# Altium schematic sheet FPGAboard.SchDoc
size A2
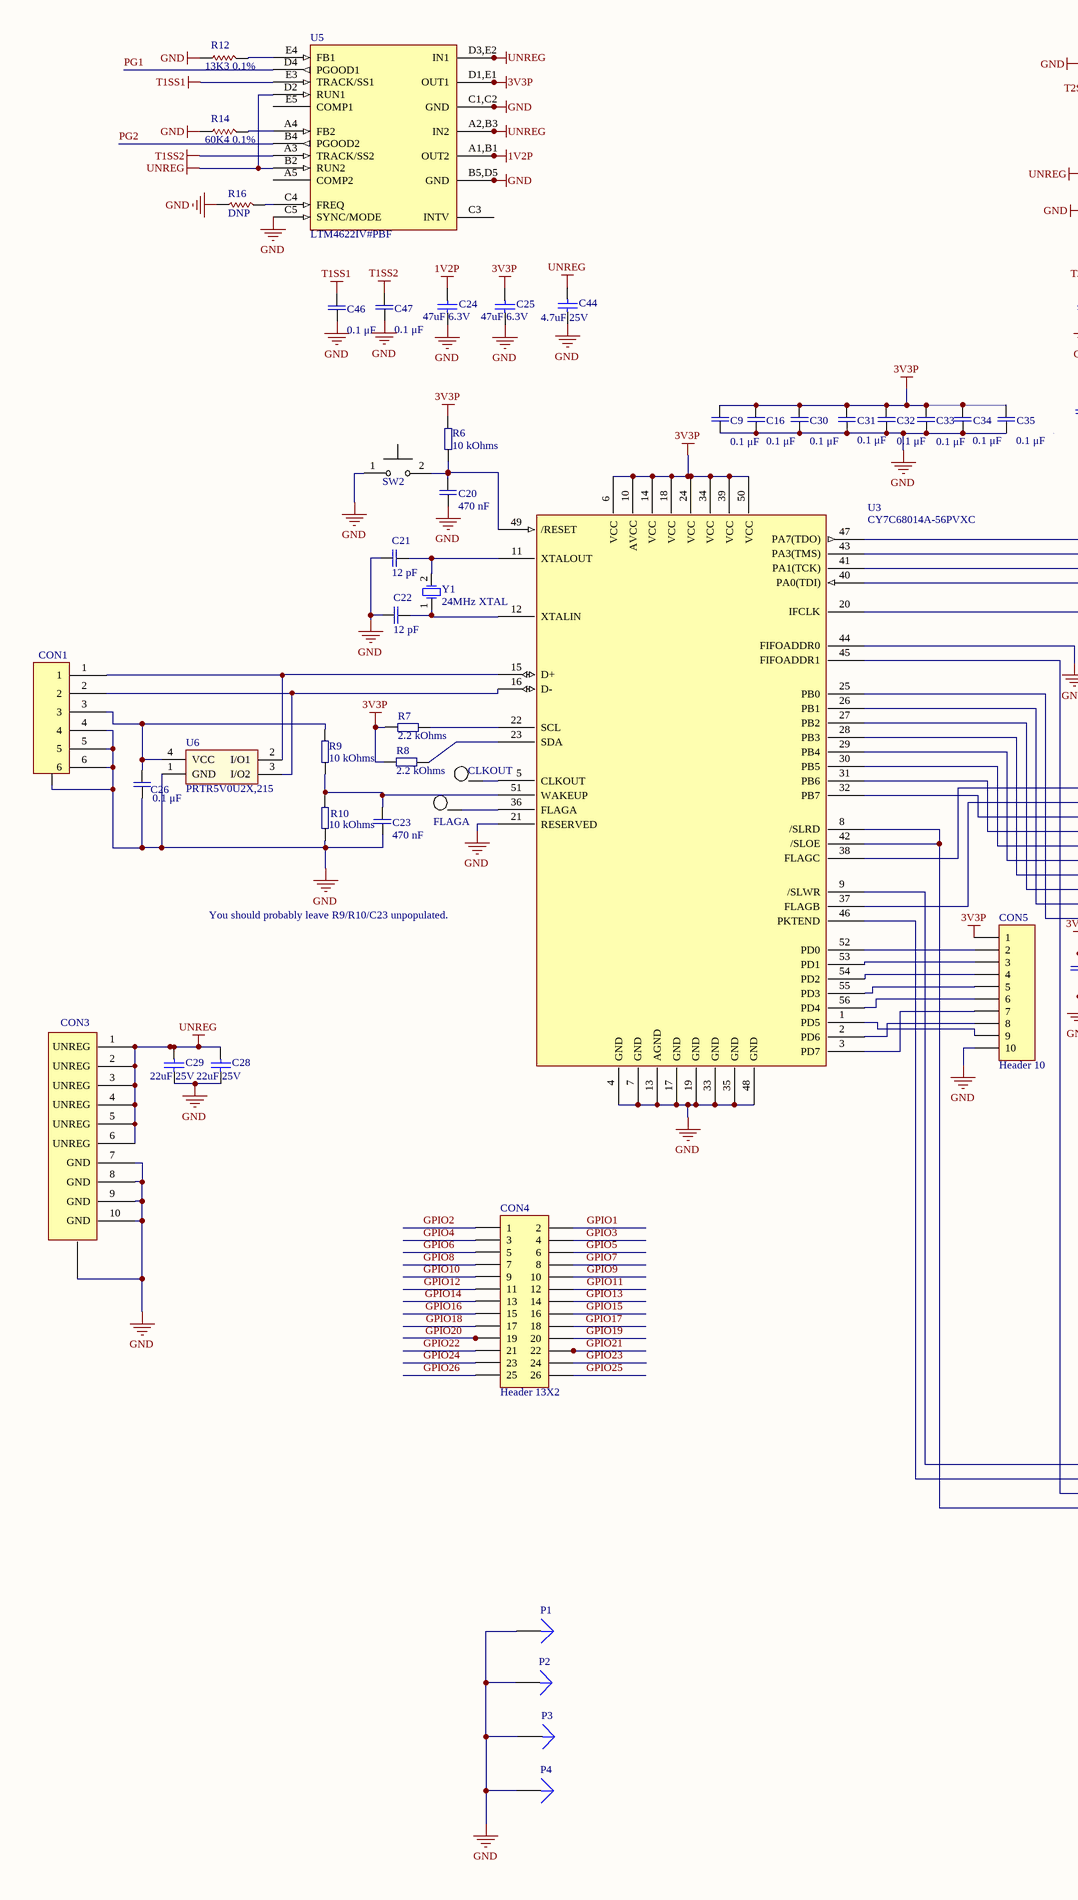
[diagram p0: FPGAboard.SchDoc, left]
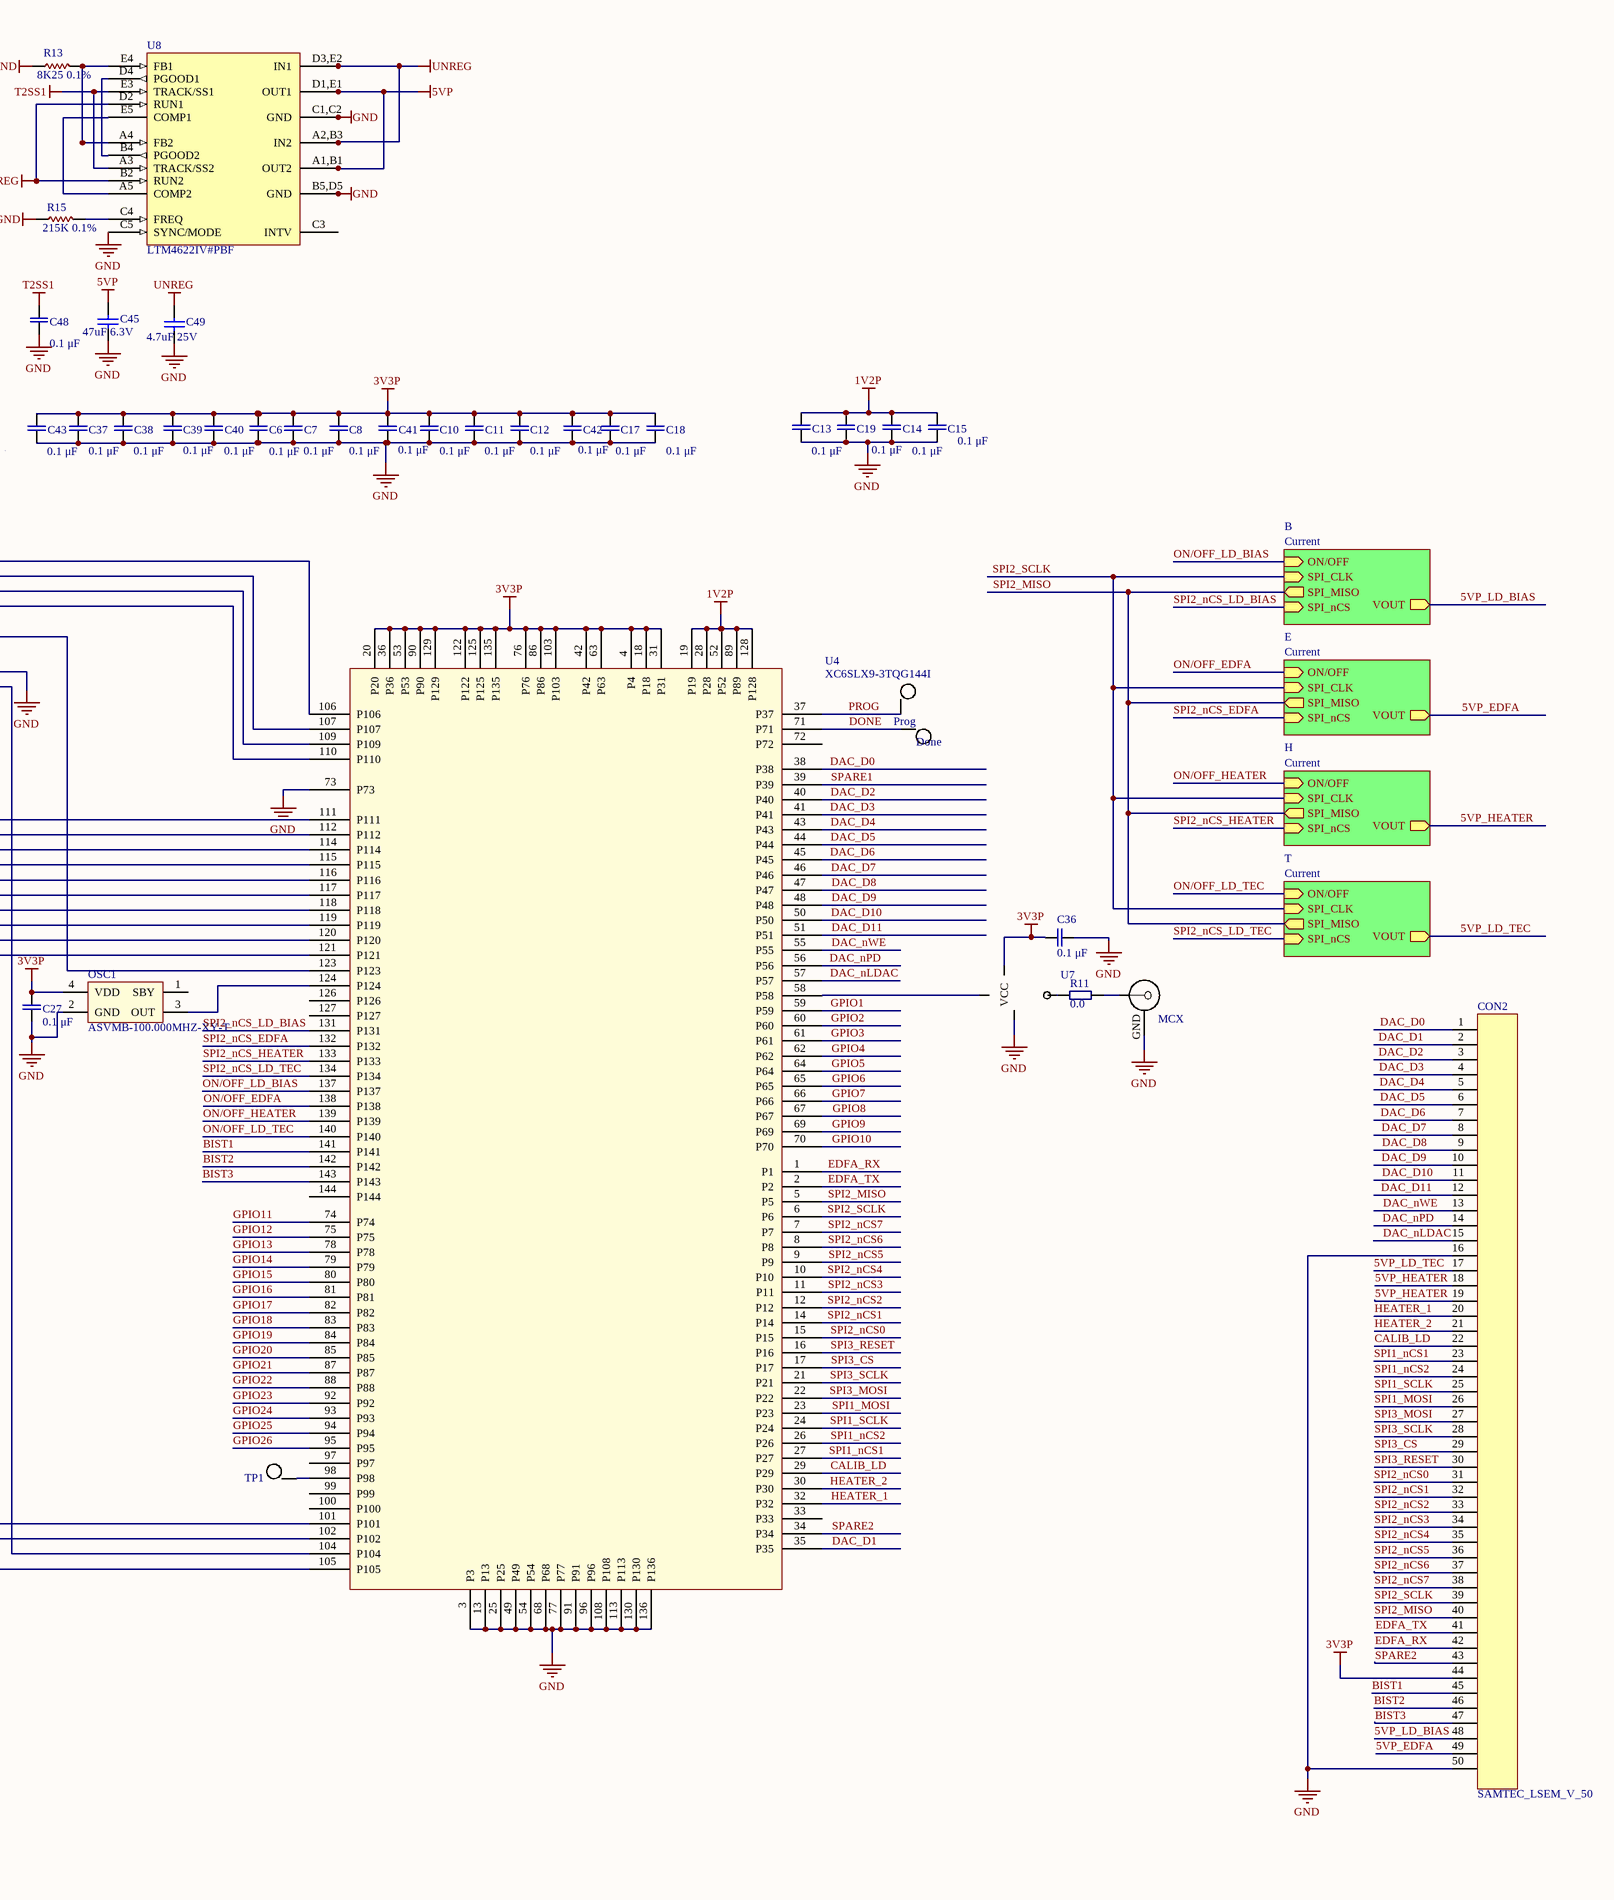
[diagram p1: FPGAboard.SchDoc, right]

## Parts
C6  Capacitance: 0.1 μF  [0805_X7R_KEMET]  (hidden comment: C0805C104K5RACTU)
C7  Capacitance: 0.1 μF  [0805_X7R_KEMET]  (hidden comment: C0805C104K5RACTU)
C8  Capacitance: 0.1 μF  [0805_X7R_KEMET]  (hidden comment: C0805C104K5RACTU)
C9  Capacitance: 0.1 μF  [0805_X7R_KEMET]  (hidden comment: C0805C104K5RACTU)
C10  Capacitance: 0.1 μF  [0805_X7R_KEMET]  (hidden comment: C0805C104K5RACTU)
C11  Capacitance: 0.1 μF  [0805_X7R_KEMET]  (hidden comment: C0805C104K5RACTU)
C12  Capacitance: 0.1 μF  [0805_X7R_KEMET]  (hidden comment: C0805C104K5RACTU)
C13  Capacitance: 0.1 μF  [0805_X7R_KEMET]  (hidden comment: C0805C104K5RACTU)
C14  Capacitance: 0.1 μF  [0805_X7R_KEMET]  (hidden comment: C0805C104K5RACTU)
C15  Capacitance: 0.1 μF  [0805_X7R_KEMET]  (hidden comment: C0805C104K5RACTU)
C16  Capacitance: 0.1 μF  [0805_X7R_KEMET]  (hidden comment: C0805C104K5RACTU)
C17  Capacitance: 0.1 μF  [0805_X7R_KEMET]  (hidden comment: C0805C104K5RACTU)
C18  Capacitance: 0.1 μF  [0805_X7R_KEMET]  (hidden comment: C0805C104K5RACTU)
C19  Capacitance: 0.1 μF  [0805_X7R_KEMET]  (hidden comment: C0805C104K5RACTU)
C20  Capacitance - nF: 470 nF  [0805_X7R_KEMET]  (hidden comment: C0805C474K5RACTU)
C21  Capacitance: 12 pF  [0805_X7R_KEMET]  (hidden comment: C0805C120J5GACTU)
C22  Capacitance: 12 pF  [0805_X7R_KEMET]  (hidden comment: C0805C120J5GACTU)
C23  Capacitance - nF: 470 nF  [0805_X7R_KEMET]  (hidden comment: C0805C474K5RACTU)
C24  47uF 6.3V  [CAPC0805(2012)145_M]
C25  47uF 6.3V  [CAPC0805(2012)145_M]
C26  Capacitance: 0.1 μF  [0805_X7R_KEMET]  (hidden comment: C0805C104K5RACTU)
C27  Capacitance: 0.1 μF  [0805_X7R_KEMET]  (hidden comment: C0805C104K5RACTU)
C28  22uF 25V  [CAPC1210(3225)220_M]
C29  22uF 25V  [CAPC1210(3225)220_M]
C30  Capacitance: 0.1 μF  [0805_X7R_KEMET]  (hidden comment: C0805C104K5RACTU)
C31  Capacitance: 0.1 μF  [0805_X7R_KEMET]  (hidden comment: C0805C104K5RACTU)
C32  Capacitance: 0.1 μF  [0805_X7R_KEMET]  (hidden comment: C0805C104K5RACTU)
C33  Capacitance: 0.1 μF  [0805_X7R_KEMET]  (hidden comment: C0805C104K5RACTU)
C34  Capacitance: 0.1 μF  [0805_X7R_KEMET]  (hidden comment: C0805C104K5RACTU)
C35  Capacitance: 0.1 μF  [0805_X7R_KEMET]  (hidden comment: C0805C104K5RACTU)
C36  Capacitance: 0.1 μF  [0805_X7R_KEMET]  (hidden comment: C0805C104K5RACTU)
C37  Capacitance: 0.1 μF  [0805_X7R_KEMET]  (hidden comment: C0805C104K5RACTU)
C38  Capacitance: 0.1 μF  [0805_X7R_KEMET]  (hidden comment: C0805C104K5RACTU)
C39  Capacitance: 0.1 μF  [0805_X7R_KEMET]  (hidden comment: C0805C104K5RACTU)
C40  Capacitance: 0.1 μF  [0805_X7R_KEMET]  (hidden comment: C0805C104K5RACTU)
C41  Capacitance: 0.1 μF  [0805_X7R_KEMET]  (hidden comment: C0805C104K5RACTU)
C42  Capacitance: 0.1 μF  [0805_X7R_KEMET]  (hidden comment: C0805C104K5RACTU)
C43  Capacitance: 0.1 μF  [0805_X7R_KEMET]  (hidden comment: C0805C104K5RACTU)
C44  4.7uF 25V  [CAPC0603(1608)100_N]
C45  47uF 6.3V  [CAPC0805(2012)145_M]
C46  Capacitance: 0.1 μF  [0805_X7R_KEMET]  (hidden comment: C0805C104K5RACTU)
C47  Capacitance: 0.1 μF  [0805_X7R_KEMET]  (hidden comment: C0805C104K5RACTU)
C48  Capacitance: 0.1 μF  [0805_X7R_KEMET]  (hidden comment: C0805C104K5RACTU)
C49  4.7uF 25V  [CAPC0603(1608)100_N]
CLKOUT  TP  [TP]  (value not drawn)
CON1  T1M-06-F-SH-L-K  [T1M-06-F-SH-L-K]  (value not drawn)
CON2  SAMTEC_LSEM_V_50  [LSEM-150-XX.X-X-DV-A-X-XX-TR]
CON3  T1M-10-F-SH-L-K  [T1M-10-F-SH-L-K]  (value not drawn)
CON4  Header 13X2  [HDR2X13]
CON5  Header 10  [HDR1X10]
Done  TP  [TP]  (value not drawn)
FLAGA  TP  [TP]  (value not drawn)
MCX  0734151061  [MCX]  (value not drawn)
OSC1  ASVMB-100.000MHZ-XY-T  [ASVMB-100.000MHZ-XY-T]
P1  Plug  [PIN1]  (value not drawn)
P2  Plug  [PIN1]  (value not drawn)
P3  Plug  [PIN1]  (value not drawn)
P4  Plug  [PIN1]  (value not drawn)
Prog  TP  [TP]  (value not drawn)
R6  Resistance: 10 kOhms  [CRCW0805_VISHAY]  (hidden comment: CRCW080510K0FKEA_)
R7  Resistance: 2.2 kOhms  [CRCW0805_VISHAY]  (hidden comment: CRCW08052K20FKEA)
R8  Resistance: 2.2 kOhms  [CRCW0805_VISHAY]  (hidden comment: CRCW08052K20FKEA)
R9  Resistance: 10 kOhms  [CRCW0805_VISHAY]  (hidden comment: CRCW080510K0FKEA_)
R10  Resistance: 10 kOhms  [CRCW0805_VISHAY]  (hidden comment: CRCW080510K0FKEA_)
R11  Resistance (Ohms): 0.0  [CRCW0805_VISHAY]  (hidden comment: CRCW08050000Z0EA)
R12  13K3 0.1%  [0402]
R13  8K25 0.1%  [0402]
R14  60K4 0.1%  [0402]
R15  215K 0.1%  [0603]
R16  DNP  [0402]
SW2  PTS645SM43SMTR92 LFS  [PTS645SM43SMTR92 LFS]  (value not drawn)
TP1  TP  [TP]  (value not drawn)
U3  CY7C68014A-56PVXC  [SSOP-56]
U4  XC6SLX9-3TQG144I  [TQG144]
U5  LTM4622IV#PBF  [LGA 25]
U6  PRTR5V0U2X,215  [SOT143B]
U7  SN74LVC1G04QDBVRQ1  [SN74LVC1G04-Q1]  (value not drawn)
U8  LTM4622IV#PBF  [LGA 25]
Y1  24MHz XTAL  [HC-49S SMD 9C Series]

## Sub-sheets
B = Current: VOUT (out), ON/OFF (in), SPI_CLK (in), SPI_MISO (out), SPI_nCS (in)
E = Current: VOUT (out), ON/OFF (in), SPI_CLK (in), SPI_MISO (out), SPI_nCS (in)
H = Current: VOUT (out), ON/OFF (in), SPI_CLK (in), SPI_MISO (out), SPI_nCS (in)
T = Current: VOUT (out), ON/OFF (in), SPI_CLK (in), SPI_MISO (out), SPI_nCS (in)

## Nets
1V2P: C13.1 C14.1 C15.1 C19.1 C24.2 U4.19(P19) U4.28(P28) U4.52(P52) U4.89(P89) U4.128(P128) U5.A1,B1(OUT2) U5.B1(OUT2)
3V3P: C6.1 C7.1 C8.1 C9.1 C10.1 C11.1 C12.1 C16.1 C17.1 C18.1 C25.2 C27.1 C30.1 C31.1 C32.1 C33.1 C34.1 C35.1 C36.1 C37.1 C38.1 C39.1 C40.1 C41.1 C42.1 C43.1 CON2.44 CON5.1 OSC1.4(VDD) R6.1 R7.1 R8.1 U3.6(VCC) U3.10(AVCC) U3.14(VCC) U3.18(VCC) U3.24(VCC) U3.34(VCC) U3.39(VCC) U3.50(VCC) U4.4(P4) U4.18(P18) U4.20(P20) U4.31(P31) U4.36(P36) U4.42(P42) U4.53(P53) U4.63(P63) U4.76(P76) U4.86(P86) U4.90(P90) U4.103(P103) U4.122(P122) U4.125(P125) U4.129(P129) U4.135(P135) U5.D1,E1(OUT1) U5.E1(OUT1) U7.5(VCC)
5VP: C45.2 U8.A1,B1(OUT2) U8.B1(OUT2) U8.D1,E1(OUT1) U8.E1(OUT1)
GND: C6.2 C7.2 C8.2 C9.2 C10.2 C11.2 C12.2 C13.2 C14.2 C15.2 C16.2 C17.2 C18.2 C19.2 C20.2 C21.1 C22.1 C23.2 C24.1 C25.1 C26.2 C27.2 C28.1 C29.1 C30.2 C31.2 C32.2 C33.2 C34.2 C35.2 C36.2 C37.2 C38.2 C39.2 C40.2 C41.2 C42.2 C43.2 C44.1 C45.1 C46.2 C47.2 C48.2 C49.1 CON1.4 CON1.5 CON1.6 CON1.GND CON2.16 CON2.50 CON3.7(GND) CON3.8(GND) CON3.9(GND) CON3.10(GND) CON3.GND CON5.10 MCX.GND OSC1.2(GND) P1.1 P2.1 P3.1 P4.1 R10.2 R12.2 R13.2 R14.2 R15.2 R16.2 SW2.1 U3.4(GND) U3.7(GND) U3.13(AGND) U3.17(GND) U3.19(GND) U3.21(RESERVED) U3.33(GND) U3.35(GND) U3.44(FIFOADDR0) U3.48(GND) U4.3(P3) U4.13(P13) U4.25(P25) U4.49(P49) U4.54(P54) U4.68(P68) U4.73(P73) U4.77(P77) U4.91(P91) U4.96(P96) U4.108(P108) U4.113(P113) U4.130(P130) U4.136(P136) U5.B5,D5(GND) U5.C1,C2(GND) U5.C2(GND) U5.C5(SYNC/MODE) U5.D5(GND) U6.1(GND) U7.3(GND) U8.B5,D5(GND) U8.C1,C2(GND) U8.C2(GND) U8.C5(SYNC/MODE) U8.D5(GND)
T1SS1: C46.1 U5.E3(TRACK/SS1)
T1SS2: C47.1 U5.A3(TRACK/SS2)
T2SS1: C48.1 U8.A3(TRACK/SS2) U8.E3(TRACK/SS1)
UNREG: C28.2 C29.2 C44.2 C49.2 CON3.1(UNREG) CON3.2(UNREG) CON3.3(UNREG) CON3.4(UNREG) CON3.5(UNREG) CON3.6(UNREG) U5.A2,B3(IN2) U5.B2(RUN2) U5.B3(IN2) U5.D2(RUN1) U5.D3,E2(IN1) U5.E2(IN1) U8.A2,B3(IN2) U8.B2(RUN2) U8.B3(IN2) U8.D2(RUN1) U8.D3,E2(IN1) U8.E2(IN1)
5VP_EDFA: CON2.49 ; sheet E/VOUT
5VP_HEATER: CON2.18 CON2.19 ; sheet H/VOUT
5VP_LD_BIAS: CON2.48 ; sheet B/VOUT
5VP_LD_TEC: CON2.17 ; sheet T/VOUT
BIST1: CON2.45 U4.141(P141)
BIST2: CON2.46 U4.142(P142)
BIST3: CON2.47 U4.143(P143)
CALIB_LD: CON2.22 U4.29(P29)
DAC_D0: CON2.1 U4.38(P38)
DAC_D1: CON2.2 U4.35(P35)
DAC_D2: CON2.3 U4.40(P40)
DAC_D3: CON2.4 U4.41(P41)
DAC_D4: CON2.5 U4.43(P43)
DAC_D5: CON2.6 U4.44(P44)
DAC_D6: CON2.7 U4.45(P45)
DAC_D7: CON2.8 U4.46(P46)
DAC_D8: CON2.9 U4.47(P47)
DAC_D9: CON2.10 U4.48(P48)
DAC_D10: CON2.11 U4.50(P50)
DAC_D11: CON2.12 U4.51(P51)
DAC_nLDAC: CON2.15 U4.57(P57)
DAC_nPD: CON2.14 U4.56(P56)
DAC_nWE: CON2.13 U4.55(P55)
DONE: Done.1 U4.71(P71)
EDFA_RX: CON2.42 U4.1(P1)
EDFA_TX: CON2.41 U4.2(P2)
GPIO1: CON4.2 U4.59(P59)
GPIO2: CON4.1 U4.60(P60)
GPIO3: CON4.4 U4.61(P61)
GPIO4: CON4.3 U4.62(P62)
GPIO5: CON4.6 U4.64(P64)
GPIO6: CON4.5 U4.65(P65)
GPIO7: CON4.8 U4.66(P66)
GPIO8: CON4.7 U4.67(P67)
GPIO9: CON4.10 U4.69(P69)
GPIO10: CON4.9 U4.70(P70)
GPIO11: CON4.12 U4.74(P74)
GPIO12: CON4.11 U4.75(P75)
GPIO13: CON4.14 U4.78(P78)
GPIO14: CON4.13 U4.79(P79)
GPIO15: CON4.16 U4.80(P80)
GPIO16: CON4.15 U4.81(P81)
GPIO17: CON4.18 U4.82(P82)
GPIO18: CON4.17 U4.83(P83)
GPIO19: CON4.20 U4.84(P84)
GPIO20: CON4.19 U4.85(P85)
GPIO21: CON4.22 U4.87(P87)
GPIO22: CON4.21 U4.88(P88)
GPIO23: CON4.24 U4.92(P92)
GPIO24: CON4.23 U4.93(P93)
GPIO25: CON4.26 U4.94(P94)
GPIO26: CON4.25 U4.95(P95)
HEATER_1: CON2.20 U4.32(P32)
HEATER_2: CON2.21 U4.30(P30)
ON/OFF_EDFA: U4.138(P138) ; sheet E/ON/OFF
ON/OFF_HEATER: U4.139(P139) ; sheet H/ON/OFF
ON/OFF_LD_BIAS: U4.137(P137) ; sheet B/ON/OFF
ON/OFF_LD_TEC: U4.140(P140) ; sheet T/ON/OFF
PG1: U5.D4(PGOOD1)
PG2: U5.B4(PGOOD2)
PROG: Prog.1 U4.37(P37)
SPARE1: U4.39(P39)
SPARE2: CON2.43 U4.34(P34)
SPI1_MOSI: CON2.26 U4.23(P23)
SPI1_nCS1: CON2.23 U4.27(P27)
SPI1_nCS2: CON2.24 U4.26(P26)
SPI1_SCLK: CON2.25 U4.24(P24)
SPI2_MISO: CON2.40 U4.5(P5) ; sheet B/SPI_MISO, sheet E/SPI_MISO, sheet H/SPI_MISO, sheet T/SPI_MISO
SPI2_nCS0: CON2.31 U4.15(P15)
SPI2_nCS1: CON2.32 U4.14(P14)
SPI2_nCS2: CON2.33 U4.12(P12)
SPI2_nCS3: CON2.34 U4.11(P11)
SPI2_nCS4: CON2.35 U4.10(P10)
SPI2_nCS5: CON2.36 U4.9(P9)
SPI2_nCS6: CON2.37 U4.8(P8)
SPI2_nCS7: CON2.38 U4.7(P7)
SPI2_nCS_EDFA: U4.132(P132) ; sheet E/SPI_nCS
SPI2_nCS_HEATER: U4.133(P133) ; sheet H/SPI_nCS
SPI2_nCS_LD_BIAS: U4.131(P131) ; sheet B/SPI_nCS
SPI2_nCS_LD_TEC: U4.134(P134) ; sheet T/SPI_nCS
SPI2_SCLK: CON2.39 U4.6(P6) ; sheet B/SPI_CLK, sheet E/SPI_CLK, sheet H/SPI_CLK, sheet T/SPI_CLK
SPI3_CS: CON2.29 U4.17(P17)
SPI3_MOSI: CON2.27 U4.22(P22)
SPI3_RESET: CON2.30 U4.16(P16)
SPI3_SCLK: CON2.28 U4.21(P21)
NetC20_1: C20.1 R6.2 SW2.2 U3.49(/RESET)
NetC21_2: C21.2 U3.11(XTALOUT) Y1.2(OSC2)
NetC22_2: C22.2 U3.12(XTALIN) Y1.1(OSC1)
NetC23_1: C23.1 R9.2 R10.1 U3.51(WAKEUP)
NetC26_1: C26.1 CON1.3 R9.1 U6.4(VCC)
NetCLKOUT_1: CLKOUT.1 U3.5(CLKOUT)
NetCON1_1: CON1.1 U3.15(D+) U6.2(I/O1)
NetCON1_2: CON1.2 U3.16(D-) U6.3(I/O2)
NetCON5_2: CON5.2 U3.52(PD0)
NetCON5_3: CON5.3 U3.53(PD1)
NetCON5_4: CON5.4 U3.54(PD2)
NetCON5_5: CON5.5 U3.55(PD3)
NetCON5_6: CON5.6 U3.56(PD4)
NetCON5_7: CON5.7 U3.3(PD7)
NetCON5_8: CON5.8 U3.2(PD6)
NetCON5_9: CON5.9 U3.1(PD5)
NetFLAGA_1: FLAGA.1 U3.36(FLAGA)
NetMCX_IN: MCX.IN R11.2
NetOSC1_3: OSC1.3(OUT) U4.124(P124)
NetR7_2: R7.2 U3.22(SCL)
NetR8_2: R8.2 U3.23(SDA)
NetR11_1: R11.1 U7.4
NetR12_1: R12.1 U5.E4(FB1)
NetR13_1: R13.1 U8.A4(FB2) U8.E4(FB1)
NetR14_1: R14.1 U5.A4(FB2)
NetR15_1: R15.1 U8.C4(FREQ)
NetR16_1: R16.1 U5.C4(FREQ)
NetTP1_1: TP1.1 U4.98(P98)
NetU3_8: U3.8(/SLRD) U3.42(/SLOE) U4.105(P105)
NetU3_9: U3.9(/SLWR) U4.101(P101)
NetU3_20: U3.20(IFCLK) U4.123(P123)
NetU3_25: U3.25(PB0) U4.121(P121)
NetU3_26: U3.26(PB1) U4.120(P120)
NetU3_27: U3.27(PB2) U4.119(P119)
NetU3_28: U3.28(PB3) U4.118(P118)
NetU3_29: U3.29(PB4) U4.117(P117)
NetU3_30: U3.30(PB5) U4.116(P116)
NetU3_31: U3.31(PB6) U4.115(P115)
NetU3_32: U3.32(PB7) U4.114(P114)
NetU3_37: U3.37(FLAGB) U4.112(P112)
NetU3_38: U3.38(FLAGC) U4.111(P111)
NetU3_40: U3.40(PA0(TDI)) U4.110(P110)
NetU3_41: U3.41(PA1(TCK)) U4.109(P109)
NetU3_43: U3.43(PA3(TMS)) U4.107(P107)
NetU3_45: U3.45(FIFOADDR1) U4.104(P104)
NetU3_46: U3.46(PKTEND) U4.102(P102)
NetU3_47: U3.47(PA7(TDO)) U4.106(P106)
NetU4_58: U4.58(P58) U7.2
NetU8_A5: U8.A5(COMP2) U8.E5(COMP1)
NetU8_B4: U8.B4(PGOOD2) U8.D4(PGOOD1)

Not connected (* = marked no-connect by the designer): OSC1 1(SBY); U4 33(P33) 72(P72) 97(P97) 99(P99) 100(P100) 126(P126) 127(P127) 144(P144); U5 A5(COMP2) C3(INTV) E5(COMP1); U8 C3(INTV)

## Notes on the sheet
- You should probably leave R9/R10/C23 unpopulated.

## Library data of the parts
C6-C19 C26 C27 C30-C43 C46-C48 = C0805C104K5RACTU: Manufacturer: Kemet; Manufacturer Part Number: C0805C104K5RAC-TU; Brand/Series: C Series; Dielectric Characteristic: X7R; Material, Element: Ceramic; Tolerance: -10, +10 %; Voltage, Rating: 50 VDC; Supplier 1: Digikey; Stock 1: 2895664; Pricing 1: 1=0.1, 10=0.053, 25=0.0388, 50=0.029, 100=0.0237, 250=0.0198, 500=0.0169, 1000=0.0133 (USD); Case Size: 0805 (2012 mm); Dimensions: 0.079" x 0.049" (2 x 1.25mm) LxW; Mounting Type: PCB; Packaging: Cut Tape; Termination: SMD; ComponentLink1URL: https://datasheet.ciiva.com/14589/70095383-14589048.pdf; ComponentLink1Description: https://datasheet.ciiva.com/14589/70095383-14589048.pdf; ComponentLink2URL: https://datasheet.ciiva.com/28682/1851736-28682232.pdf; ComponentLink2Description: https://datasheet.ciiva.com/28682/1851736-28682232.pdf; ComponentLink3URL: https://datasheet.ciiva.com/7842/1851736-7842539.pdf; ComponentLink3Description: https://datasheet.ciiva.com/7842/1851736-7842539.pdf; ComponentLink4URL: https://datasheet.ciiva.com/32431/slceramic-chip-condensers-e-32431755.pdf; ComponentLink4Description: https://datasheet.ciiva.com/32431/slceramic-chip-condensers-e-32431755.pdf; ComponentLink5URL: https://datasheet.ciiva.com/18410/70095383-18410815.pdf; ComponentLink5Description: https://datasheet.ciiva.com/18410/70095383-18410815.pdf; Supplier Part Number 1: 399-1170-1-ND
C20 C23 = C0805C474K5RACTU: Manufacturer: KEMET; Part # Aliases: C0805C474K5RAC7800; Capacitance: 0.47 uF; Capacitance - pF: 470000 pF; Case Height: 1 mm; Dielectric: X7R; Case Length: 2 mm; Case Width: 1.2 mm; Class: Class 1; Voltage Rating: 50 V; Tolerance: 10 %; Temperature Coefficient / Code: +/- 15 %; Type: SMD MLCC X7R 6.3 - 250 VDC Commerical Grade; Supplier 1: Digikey; Manufacturer Part Number: C0805C474K5RACTU; Stock 1: 94831; Pricing 1: 1=0.28, 10=0.193, 100=0.1092, 500=0.0771, 1000=0.0675 (USD); Brand: Kemet; Case Code - in: 0805; Case Code - mm: 2012; Dimensions: 1.2 mm W x 2 mm L x 1 mm H; Factory Pack Quantity: 2500; Product Category: Multilayer Ceramic Capacitors MLCC - SMD/SMT; RoHS: Details; Voltage Rating DC: 50 V; Minimum Operating Temperature: - 55 C; Maximum Operating Temperature: + 125 C; Product: General Type MLCCs; Operating Temperature Range: - 55 C to + 125 C; Package / Case: 0805 (2012 metric); Packaging: Reel; Series: C0805C; Termination Style: SMD/SMT; ComponentLink1URL: https://datasheet.ciiva.com/7842/1851736-7842613.pdf; ComponentLink1Description: https://datasheet.ciiva.com/7842/1851736-7842613.pdf; ComponentLink2URL: https://datasheet.ciiva.com/28688/1851736-28688678.pdf; ComponentLink2Description: https://datasheet.ciiva.com/28688/1851736-28688678.pdf; ComponentLink3URL: https://datasheet.ciiva.com/6126/kem-c1002-x7r-smd-6126343.pdf; ComponentLink3Description: https://datasheet.ciiva.com/6126/kem-c1002-x7r-smd-6126343.pdf; ComponentLink4URL: https://datasheet.ciiva.com/28614/1918693-28614762.pdf; ComponentLink4Description: https://datasheet.ciiva.com/28614/1918693-28614762.pdf; ComponentLink5URL: https://datasheet.ciiva.com/5411/kem-c1002-x7r-smd-5411451.pdf; ComponentLink5Description: https://datasheet.ciiva.com/5411/kem-c1002-x7r-smd-5411451.pdf; ComponentLink6URL: https://datasheet.ciiva.com/14604/70095383-14604428.pdf; ComponentLink6Description: https://datasheet.ciiva.com/14604/70095383-14604428.pdf; ComponentLink7URL: https://datasheet.ciiva.com/14589/70095383-14589439.pdf; ComponentLink7Description: https://datasheet.ciiva.com/14589/70095383-14589439.pdf; Supplier Part Number 1: 399-8100-1-ND
C21 C22 = C0805C120J5GACTU: Manufacturer: KEMET; Part # Aliases: C0805C120J5GAC7800; Case Height: 0.78 mm; Case Length: 2 mm; Dielectric: C0G (NP0); Case Width: 1.2 mm; Class: Class 1; Dissipation Factor DF: 0.1; Voltage Rating: 50 V; Tolerance: 5 %; Temperature Coefficient / Code: +/- 30 PPM / C; Type: SMD MLCC C0G 10 - 250 VDC Commercial Grade; Supplier 1: Digikey; Manufacturer Part Number: C0805C120J5GACTU; Stock 1: 56795; Pricing 1: 1=0.12, 10=0.085, 100=0.0402, 500=0.0282, 1000=0.0233 (USD); Brand: Kemet; Case Code - in: 0805; Case Code - mm: 2012; Dimensions: 1.2 mm W x 2 mm L x 0.78 mm H; Lead Spacing: 0.75 mm; Factory Pack Quantity: 4000; Product Category: Multilayer Ceramic Capacitors MLCC - SMD/SMT; RoHS: Details; Voltage Rating DC: 50 V; Minimum Operating Temperature: - 55 C; Maximum Operating Temperature: + 125 C; Product: General Type MLCCs; Operating Temperature Range: - 55 C to + 125 C; Package / Case: 0805 (2012 metric); Packaging: Reel; Series: C0805C; Termination Style: SMD/SMT; ComponentLink1URL: https://datasheet.ciiva.com/144/docfinderpartnumber-c0805c120j5gactu-144980.pdf; ComponentLink1Description: https://datasheet.ciiva.com/144/docfinderpartnumber-c0805c120j5gactu-144980.pdf; ComponentLink2URL: https://datasheet.ciiva.com/11463/kem-c1003-c0g-smd-11463493.pdf; ComponentLink2Description: https://datasheet.ciiva.com/11463/kem-c1003-c0g-smd-11463493.pdf; ComponentLink3URL: https://datasheet.ciiva.com/18193/getdatasheetpartid-179336-18193526.pdf; ComponentLink3Description: https://datasheet.ciiva.com/18193/getdatasheetpartid-179336-18193526.pdf; ComponentLink4URL: https://datasheet.ciiva.com/5418/kem-c1003-c0g-smd-356956-5418089.pdf; ComponentLink4Description: https://datasheet.ciiva.com/5418/kem-c1003-c0g-smd-356956-5418089.pdf; ComponentLink5URL: https://datasheet.ciiva.com/6136/1732692-6136713.pdf; ComponentLink5Description: https://datasheet.ciiva.com/6136/1732692-6136713.pdf; ComponentLink6URL: https://datasheet.ciiva.com/7842/1732692-7842203.pdf; ComponentLink6Description: https://datasheet.ciiva.com/7842/1732692-7842203.pdf; ComponentLink7URL: https://datasheet.ciiva.com/7842/1732692-7842204.pdf; ComponentLink7Description: https://datasheet.ciiva.com/7842/1732692-7842204.pdf; ComponentLink8URL: https://datasheet.ciiva.com/14586/70095383-14586716.pdf; ComponentLink8Description: https://datasheet.ciiva.com/14586/70095383-14586716.pdf; ComponentLink9URL: https://datasheet.ciiva.com/28696/1789732-28696013.pdf; ComponentLink9Description: https://datasheet.ciiva.com/28696/1789732-28696013.pdf; Supplier Part Number 1: 399-1110-1-ND
C24 C25 C45 = CMP-1036-04876-1: GRM21BR60J476ME15L; Case-EIA: 0805; Case-Metric: 2012; Tolerance: Â±10%; Value: 4.7uF; Technology: SMT; Max Thickness: 1.45 mm; Rated Voltage: 6.3 V
C28 C29 = CMP-1038-02286-1: C1210C226M3PACTU; Case-Metric: 3225; Tolerance: -20% to +80%; Case-EIA: 1210; Rated Voltage: 25 V; Technology: SMT; Max Thickness: 2.2 mm; Value: 22uF
C44 C49 = CMP-1035-01192-1: GRM188C81E475KE11D; Value: 75pF; Case-Metric: 1608; Case-EIA: 0603; Tolerance: Â±10%; Technology: SMT; Rated Voltage: 25 V; Max Thickness: 1 mm
CLKOUT Done FLAGA Prog TP1 = TP: Test point
CON1 = T1M-06-F-SH-L-K: 6 Positions Header Connector Surface Mount, Right Angle; Manufacturer: Samtec; Supplier 1: Digi-Key; Manufacturer Part Number: T1M-06-F-SH-L-K; Stock 1: 0; Supplier Part Number 1: SAM11991-ND
CON2 = SAMTEC_LSEM_V_50: SAMTEC connector
CON3 = T1M-10-F-SH-L-K: 10 Positions Header Connector Surface Mount, Right Angle
CON4 = Header 13X2: Header, 13-Pin, Dual row; LatestRevisionDate: 17-Jul-2002; LatestRevisionNote: Re-released for DXP Platform.; Publisher: Altium Limited
CON5 = Header 10: Header, 10-Pin; LatestRevisionDate: 17-Jul-2002; LatestRevisionNote: Re-released for DXP Platform.; Publisher: Altium Limited
MCX = 0734151061: CONN MCX RCPT STR 50OHM EDGE MNT; Manufacturer: Molex; Featured Product: MCX RF Connectors; Connector Type: Receptacle, Female Socket; Contact Termination: Solder; Frequency - Max: 6GHz; Body Material: Brass; Body Finish: Gold; Center Contact Material: Beryllium Copper; Dielectric Material: Polytetrafluoroethylene (PTFE); Voltage Rating: 335V; Online Catalog: MCX, 73366 and 73415 Series; Other Names: 0734-15-1061  073415-1061  0734151061-ND  73415-1061  734151061  WM9351-2-ND  WM9351TR; Supplier 1: Digi-Key; Manufacturer Part Number: 0734151061; Stock 1: 18986; Pricing 1: 1=5.45, 10=5.23, 25=4.7944, 50=4.5764, 100=4.3584, 250=3.8136, 500=3.7047 (USD); RoHS Information: 0734151061 Cert of Compliance; Standard Package: 1,000; Category: Connectors, Interconnects; Family: Coaxial Connectors (RF); Series: 73415; Packaging: Tape & Reel (TR); Connector Style: MCX; Shield Termination: Solder; Impedance: 50 Ohm; Mounting Type: Board Edge, Cutout; Cable Group: -; Fastening Type: Snap-On; Features: -; Housing Color: Gold; Ingress Protection: -; Center Contact Plating: Gold; Operating Temperature: -55°C ~ 155°C; ComponentLink1URL: https://datasheet.ciiva.com/7002/0734151061-rf-coax-connectors-7002503.pdf; ComponentLink1Description: https://datasheet.ciiva.com/7002/0734151061-rf-coax-connectors-7002503.pdf; ComponentLink2URL: https://datasheet.ciiva.com/7002/0734151061-rf-coax-connectors-7002509.pdf; ComponentLink2Description: https://datasheet.ciiva.com/7002/0734151061-rf-coax-connectors-7002509.pdf; Supplier Part Number 1: WM9351CT-ND
OSC1 = ASVMB-100.000MHZ-XY-T: Manufacturer: Abracon; Rad Hard: No; Frequency Stability: ±10 ppm; Load Capacitance: 15 pF; Standard Frequency: 100 MHz; Supplier 1: Digikey; Manufacturer Part Number: ASVMB-100.000MHZ-XY-T; Stock 1: 1752; Pricing 1: 1=2.51, 10=2.449, 50=2.332, 100=2.0405, 500=1.9822 (USD); Packaging: Tape & Reel; Package: 4QFN EP; Type: Silicon Oscillator; Category: SMD Crystal Oscillator; ComponentLink1URL: https://datasheet.ciiva.com/13167/asvmb-35165-13167142.pdf; ComponentLink1Description: https://datasheet.ciiva.com/13167/asvmb-35165-13167142.pdf; ComponentLink2URL: https://datasheet.ciiva.com/866/asvmb-866791.pdf; ComponentLink2Description: https://datasheet.ciiva.com/866/asvmb-866791.pdf; ComponentLink3URL: https://datasheet.ciiva.com/866/asvmb-866792.pdf; ComponentLink3Description: https://datasheet.ciiva.com/866/asvmb-866792.pdf; ComponentLink4URL: https://datasheet.ciiva.com/866/asvmb-866793.pdf; ComponentLink4Description: https://datasheet.ciiva.com/866/asvmb-866793.pdf; Supplier Part Number 1: 535-11246-1-ND
R6 R9 R10 = CRCW080510K0FKEA_: Manufacturer: Vishay; Brand: Vishay / Dale; Power Rating: 125 mW (1/8 W); Tolerance: 1 %; Temperature Coefficient: 100 PPM / K; Voltage Rating: 150 V; Case Height: 0.45 mm; Case Length: 2 mm; Case Width: 1.25 mm; Unit Weight: 0.000194 oz; Supplier 1: Digikey; Manufacturer Part Number: CRCW080510K0FKEA; Stock 1: 0; Pricing 1: 1=0.1, 10=0.042, 25=0.0304, 50=0.0232, 100=0.017, 250=0.013, 500=0.0104, 1000=0.0077 (USD); Product Category: Thick Film Resistors - SMD; RoHS: Details; Case Code - in: 0805; Case Code - mm: 2012; Operating Temperature Range: - 55 C to + 155 C; Package / Case: 0805 (2012 metric); Packaging: Reel; Product: Thick Film Resistors SMD; Series: CRCW; Factory Pack Quantity: 5000; ComponentLink1URL: https://datasheet.ciiva.com/5547/dcrcwe3-109170-5547559.pdf; ComponentLink1Description: https://datasheet.ciiva.com/5547/dcrcwe3-109170-5547559.pdf; ComponentLink2URL: https://datasheet.ciiva.com/11808/0900766b80d98b26-11808216.pdf; ComponentLink2Description: https://datasheet.ciiva.com/11808/0900766b80d98b26-11808216.pdf; ComponentLink3URL: https://datasheet.ciiva.com/16719/70201119-16719082.pdf; ComponentLink3Description: https://datasheet.ciiva.com/16719/70201119-16719082.pdf; ComponentLink4URL: https://datasheet.ciiva.com/16514/dcrcwe3-16514907.pdf; ComponentLink4Description: https://datasheet.ciiva.com/16514/dcrcwe3-16514907.pdf; ComponentLink5URL: https://datasheet.ciiva.com/16883/dcrcwe3-16883708.pdf; ComponentLink5Description: https://datasheet.ciiva.com/16883/dcrcwe3-16883708.pdf; ComponentLink6URL: https://datasheet.ciiva.com/8337/dcrcwe3-8337773.pdf; ComponentLink6Description: https://datasheet.ciiva.com/8337/dcrcwe3-8337773.pdf; ComponentLink7URL: https://datasheet.ciiva.com/16755/70201119-16755389.pdf; ComponentLink7Description: https://datasheet.ciiva.com/16755/70201119-16755389.pdf; ComponentLink8URL: https://datasheet.ciiva.com/46394/1720486-46394381.pdf; ComponentLink8Description: https://datasheet.ciiva.com/46394/1720486-46394381.pdf; ComponentLink9URL: https://datasheet.ciiva.com/8337/dcrcwe3-8337774.pdf; ComponentLink9Description: https://datasheet.ciiva.com/8337/dcrcwe3-8337774.pdf; ComponentLink10URL: https://datasheet.ciiva.com/16199/dcrcwe3-16199086.pdf; ComponentLink10Description: https://datasheet.ciiva.com/16199/dcrcwe3-16199086.pdf; Supplier Part Number 1: 541-10.0KCCT-ND
R7 R8 = CRCW08052K20FKEA: Manufacturer: Vishay; Brand: Vishay / Dale; Tolerance: 1 %; Power Rating: 125 mW (1/8 W); Temperature Coefficient: 100 PPM / K; Voltage Rating: 150 V; Unit Weight: 0.000194 oz; Supplier 1: Digikey; Manufacturer Part Number: CRCW08052K20FKEA; Stock 1: 0; Pricing 1: 1=0.1, 10=0.046, 100=0.0187, 1000=0.0084, 2500=0.0073 (USD); Product Category: Thick Film Resistors - SMD; RoHS: Details; Case Code - in: 0805; Case Code - mm: 2012; Operating Temperature Range: - 55 C to + 155 C; Series: CRCW; Height: 0.45 mm; Length: 2 mm; Package / Case: 0805 (2012 metric); Packaging: Reel; Product: Thick Film Resistors SMD; Factory Pack Quantity: 5000; Termination Style: SMD/SMT; Width: 1.25 mm; ComponentLink1URL: https://datasheet.ciiva.com/11808/0900766b80d98b26-11808384.pdf; ComponentLink1Description: https://datasheet.ciiva.com/11808/0900766b80d98b26-11808384.pdf; ComponentLink2URL: https://datasheet.ciiva.com/5546/dcrcwe3-109170-5546726.pdf; ComponentLink2Description: https://datasheet.ciiva.com/5546/dcrcwe3-109170-5546726.pdf; ComponentLink3URL: https://datasheet.ciiva.com/17201/dcrcwe3-17201814.pdf; ComponentLink3Description: https://datasheet.ciiva.com/17201/dcrcwe3-17201814.pdf; ComponentLink4URL: https://datasheet.ciiva.com/7777/1697337-7777385.pdf; ComponentLink4Description: https://datasheet.ciiva.com/7777/1697337-7777385.pdf; ComponentLink5URL: https://datasheet.ciiva.com/16201/dcrcwe3-16201450.pdf; ComponentLink5Description: https://datasheet.ciiva.com/16201/dcrcwe3-16201450.pdf; ComponentLink6URL: https://datasheet.ciiva.com/7777/1720486-7777611.pdf; ComponentLink6Description: https://datasheet.ciiva.com/7777/1720486-7777611.pdf; ComponentLink7URL: https://datasheet.ciiva.com/16770/70201119-16770763.pdf; ComponentLink7Description: https://datasheet.ciiva.com/16770/70201119-16770763.pdf; ComponentLink8URL: https://datasheet.ciiva.com/2525/dcrcwe3-2525869.pdf; ComponentLink8Description: https://datasheet.ciiva.com/2525/dcrcwe3-2525869.pdf; ComponentLink9URL: https://datasheet.ciiva.com/2525/dcrcwe3-2525870.pdf; ComponentLink9Description: https://datasheet.ciiva.com/2525/dcrcwe3-2525870.pdf; ComponentLink10URL: https://datasheet.ciiva.com/3258/dcrcwe3-3258430.pdf; ComponentLink10Description: https://datasheet.ciiva.com/3258/dcrcwe3-3258430.pdf; ComponentLink11URL: https://datasheet.ciiva.com/2525/dcrcwe3-2525871.pdf; ComponentLink11Description: https://datasheet.ciiva.com/2525/dcrcwe3-2525871.pdf; ComponentLink12URL: https://datasheet.ciiva.com/3258/dcrcwe3-3258431.pdf; ComponentLink12Description: https://datasheet.ciiva.com/3258/dcrcwe3-3258431.pdf; Supplier Part Number 1: 541-2.20KCCT-ND
R11 = CRCW08050000Z0EA: Manufacturer: Vishay; EDA / CAD Models: Download from Accelerated Designs; Tolerance: Jumper; Power (Watts): 0.125W, 1/8W; Online Catalog: CRCW - Automotive Series; Kits: 541-1420-ND  - RESISTOR KIT 0-1M 1/8W 6100PCS; Other Names: 541-0.0ACT; Supplier 1: Digikey; Manufacturer Part Number: CRCW08050000Z0EA; Stock 1: 1015935; Pricing 1: 1=0.1, 10=0.026, 25=0.0184, 50=0.014, 100=0.0104, 250=0.0079, 500=0.0063, 1000=0.0047 (USD); Standard Package: 1; Category: Resistors; Family: Chip Resistor - Surface Mount; Series: CRCW; Packaging: Cut Tape (CT); Composition: Thick Film; Features: Automotive AEC-Q200; Temperature Coefficient: -; Operating Temperature: -55°C ~ 155°C; Package / Case: 0805 (2012 Metric); Supplier Device Package: 0805 (2012 Metric); Size / Dimension: 0.079" L x 0.049" W (2.00mm x 1.25mm); Height: 0.020" (0.50mm); Number of Terminations: 2; ComponentLink1URL: https://datasheet.ciiva.com/16883/dcrcwe3-16883622.pdf; ComponentLink1Description: https://datasheet.ciiva.com/16883/dcrcwe3-16883622.pdf; ComponentLink2URL: https://datasheet.ciiva.com/26314/fld-crcw-e3-data-en-26314630.pdf; ComponentLink2Description: https://datasheet.ciiva.com/26314/fld-crcw-e3-data-en-26314630.pdf; ComponentLink3URL: https://datasheet.ciiva.com/5543/dcrcwe3-109170-5543096.pdf; ComponentLink3Description: https://datasheet.ciiva.com/5543/dcrcwe3-109170-5543096.pdf; ComponentLink4URL: https://datasheet.ciiva.com/11811/0900766b80d98b26-11811304.pdf; ComponentLink4Description: https://datasheet.ciiva.com/11811/0900766b80d98b26-11811304.pdf; ComponentLink5URL: https://datasheet.ciiva.com/16389/dcrcwe3-16389338.pdf; ComponentLink5Description: https://datasheet.ciiva.com/16389/dcrcwe3-16389338.pdf; ComponentLink6URL: https://datasheet.ciiva.com/16719/70201119-16719706.pdf; ComponentLink6Description: https://datasheet.ciiva.com/16719/70201119-16719706.pdf; ComponentLink7URL: https://datasheet.ciiva.com/2463/dcrcwe3-2463037.pdf; ComponentLink7Description: https://datasheet.ciiva.com/2463/dcrcwe3-2463037.pdf; ComponentLink8URL: https://datasheet.ciiva.com/7841/1697337-7841629.pdf; ComponentLink8Description: https://datasheet.ciiva.com/7841/1697337-7841629.pdf; ComponentLink9URL: https://datasheet.ciiva.com/2463/dcrcwe3-2463038.pdf; ComponentLink9Description: https://datasheet.ciiva.com/2463/dcrcwe3-2463038.pdf; ComponentLink10URL: https://datasheet.ciiva.com/2463/dcrcwe3-2463039.pdf; ComponentLink10Description: https://datasheet.ciiva.com/2463/dcrcwe3-2463039.pdf; ComponentLink11URL: https://datasheet.ciiva.com/7841/1720486-7841839.pdf; ComponentLink11Description: https://datasheet.ciiva.com/7841/1720486-7841839.pdf; Supplier Part Number 1: 541-0.0ACT-ND
R12-R14 R16 = RES 0402: 402 Resistor
R15 = RES 0603: 603 Resistor
SW2 = PTS645SM43SMTR92 LFS: SWITCH TACTILE SPST-NO 0.05A 12V; Manufacturer: ITT /  C&K Components; Pole Throw Configuration: SPST; Mechanical Life: 100000 Cycles; Switch Configuration: N.O.; Illumination Type: N/R; Ground Terminal: No; Body Orientation: Straight; Actuator Length: 0.85 mm; Maximum Contact Resistance: 100 mOhm; Operating Force: 1.57 N; Actuator Style: Round Button; Dielectric Strength: 250 VAC; Minimum Insulation Resistance: 100000 MOhm; Contact Rating @ Voltage: 0.05@12VDC A; Supplier 1: C&K Components; Manufacturer Part Number: PTS645SM43SMTR92LFS; Stock 1: 468020; Pricing 1: 1=0.15, 10=0.147, 25=0.1416, 50=0.1366, 100=0.129, 250=0.1214, 500=0.1164 (USD); Part No: PTS645SM43SMTR92LFS; RoHS: Yes; Supplier Standard Pack: 1,000; Type: N/A; Maximum AC Voltage Rating: N/A; Family: PTS645; Contact Material: N/A; Actuator Color: N/A; Maximum DC Voltage Rating: 12 V; Seal Description: N/A; Packaging: Tape and Reel; Contact Plating: Silver; Electrical Life: N/A; Housing Material: N/A; Product Weight: N/A; Base Material: N/A; Mounting: Surface Mount,Gull Wing; Seal Location: N/A; Operating Temperature: -20 to 60 C; Dimension: 6 x 9 x 4.3 mm; ComponentLink1URL: https://datasheet.ciiva.com/29903/getdatasheetpartid-786341-29903846.pdf; ComponentLink1Description: https://datasheet.ciiva.com/29903/getdatasheetpartid-786341-29903846.pdf; ComponentLink2URL: https://datasheet.ciiva.com/14920/pts645-14920733.pdf; ComponentLink2Description: https://datasheet.ciiva.com/14920/pts645-14920733.pdf; ComponentLink3URL: https://datasheet.ciiva.com/14920/pts645-14920734.pdf; ComponentLink3Description: https://datasheet.ciiva.com/14920/pts645-14920734.pdf; ComponentLink4URL: https://datasheet.ciiva.com/14920/pts645-14920735.pdf; ComponentLink4Description: https://datasheet.ciiva.com/14920/pts645-14920735.pdf; ComponentLink5URL: https://datasheet.ciiva.com/29931/getdatasheetpartid-764615-29931183.pdf; ComponentLink5Description: https://datasheet.ciiva.com/29931/getdatasheetpartid-764615-29931183.pdf; Supplier Part Number 1: CKN9112CT-ND
U3 = CY7C68014A-56PVXC: IC MCU USB PERIPH HI SPD 56SSOP; Manufacturer: Cypress; Core: 8051; Data Bus Width: 8 bit/16 bit; Data RAM Size: 16 KB; Interface Type: GPIF, I2C, USART; Maximum Clock Frequency: 48 MHz; On-Chip ADC: No; Operating Supply Voltage: 3 V to 3.6 V; Number of Programmable I/Os: 24; Number of Timers: 3; Processor Series: CY7C68xx; Program Memory Type: ROMLess; Supply Voltage - Max: 3.6 V; Supply Voltage - Min: 3 V; Supplier 1: Digikey; Manufacturer Part Number: CY7C68014A-56PVXC; Stock 1: 503; Pricing 1: 1=13.46, 10=12.24, 52=11.3219, 104=10.404, 260=9.486, 520=8.874, 1040=8.1396 (USD); Factory Pack Quantity: 26; Mounting Style: SMD/SMT; Maximum Operating Temperature: + 70 C; Minimum Operating Temperature: 0 C; Product Category: 8-bit Microcontrollers - MCU; RoHS: Details; Operating Temperature Range: 0 C to + 70 C; Package / Case: SSOP-56; Packaging: Tube; ComponentLink1URL: https://datasheet.ciiva.com/7627/43447-7627897.pdf; ComponentLink1Description: https://datasheet.ciiva.com/7627/43447-7627897.pdf; ComponentLink2URL: https://datasheet.ciiva.com/5824/43447-5824174.pdf; ComponentLink2Description: https://datasheet.ciiva.com/5824/43447-5824174.pdf; ComponentLink3URL: https://datasheet.ciiva.com/26821/cy7c68014a-56pvxc-26821370.pdf; ComponentLink3Description: https://datasheet.ciiva.com/26821/cy7c68014a-56pvxc-26821370.pdf; Supplier Part Number 1: 428-1673-ND
U4 = XC6SLX9-3TQG144I: IC FPGA 102 I/O 144TQFP; Manufacturer: Xilinx; Product Training Modules: S6 Family Overview; PCN Design/Specification: Shipping Tray TQ144 and TQG144 12/Aug/2013; Number of LABs/CLBs: 715; Number of Logic Elements/Cells: 9152; Total RAM Bits: 589824; Number of I/O: 102; Voltage - Supply: 1.14 V ~ 1.26 V; Online Catalog: Spartan®-6 LX; For Use With: 1286-1046-ND                                                          - BOARD CMOD S6 FPGA 48DIP                                                     102990017-ND                                                          - PAPILIO PRO                                                     DEV-11953-ND                                                          - DEV BOARD MOJO V3 FPGA; Other Names: 122-1748  XC6SLX9-3TQG144I-ND  XC6SLX93TQG144I; Supplier 1: Digikey; Manufacturer Part Number: XC6SLX9-3TQG144I; Stock 1: 2437; Pricing 1: 1=20.86 (USD); Standard Package: 1; Category: Integrated Circuits (ICs); Family: Embedded - FPGAs (Field Programmable Gate Array); Series: Spartan® 6 LX; Number of Gates: -; Mounting Type: Surface Mount; Operating Temperature: -40°C ~ 100°C (TJ); Package / Case: 144-LQFP; Supplier Device Package: 144-TQFP (20x20); ComponentLink1URL: https://datasheet.ciiva.com/1442/ds160-1442503.pdf; ComponentLink1Description: https://datasheet.ciiva.com/1442/ds160-1442503.pdf; Supplier Part Number 1: 122-1748-ND
U5 U8 = LTM4622: Dual Ultrathin 2.5A or Single 5A Step-Down DC/DC μModule Regulator; Ref: LTM4622IV#PBF
U6 = PRTR5V0U2X,215: TVS DIODE 5.5VWM SOT143B; Manufacturer: NXP Semiconductors; Capacitance Value: 16pF; Configuration: Quad; Direction Type: Uni-Directional; ESD Protection Voltage: 8KV@Contact Disc; Leakage Current: 0.1uA; Number of  Elements: 1; Product Depth (mm): 1.4 mm; Product Height (mm): 1 mm; Product Length (mm): 3 mm; Rad Hardened: No; Reverse Breakdown Voltage: 6 V; Reverse Stand-off Voltage: 5.5 V; Suppressor Type: Diode Arrays; Working Voltage: 5.5V; Supplier 1: Digi-Key; Manufacturer Part Number: PRTR5V0U2X,215; Stock 1: 73838; Pricing 1: 1=0.52, 10=0.447, 100=0.334, 500=0.2624, 1000=0.2028 (USD); Leakage Current (Max): 0.1uA; Mounting: Surface Mount; Mounting Style: Surface Mount; Operating Temp Range: -40C to 85C; Operating Temperature Classification: Industrial; Operating Temperature Max Deg. C: 85C; Operating Temperature Min Deg. C: -40C; Package / Case: SOT; Package Type: SOT; Packaging: Tape and Reel; Pin Count: 3 +Tab; Polarity: Uni-Directional; Working Voltage (Max): 5.5V; ComponentLink1URL: https://datasheet.ciiva.com/4479/prtr5v0u2x-102853-4479461.pdf; ComponentLink1Description: https://datasheet.ciiva.com/4479/prtr5v0u2x-102853-4479461.pdf; ComponentLink2URL: https://datasheet.ciiva.com/16199/prtr5v0u2x-16199605.pdf; ComponentLink2Description: https://datasheet.ciiva.com/16199/prtr5v0u2x-16199605.pdf; ComponentLink3URL: https://datasheet.ciiva.com/28409/109718-28409830.pdf; ComponentLink3Description: https://datasheet.ciiva.com/28409/109718-28409830.pdf; ComponentLink4URL: https://datasheet.ciiva.com/6918/109718-6918650.pdf; ComponentLink4Description: https://datasheet.ciiva.com/6918/109718-6918650.pdf; ComponentLink5URL: https://datasheet.ciiva.com/335/prtr5v0u2x-335467.pdf; ComponentLink5Description: https://datasheet.ciiva.com/335/prtr5v0u2x-335467.pdf; ComponentLink6URL: https://datasheet.ciiva.com/25919/prtr5v0u2x-25919147.pdf; ComponentLink6Description: https://datasheet.ciiva.com/25919/prtr5v0u2x-25919147.pdf; ComponentLink7URL: https://datasheet.ciiva.com/11193/prtr5v0u2x-11193230.pdf; ComponentLink7Description: https://datasheet.ciiva.com/11193/prtr5v0u2x-11193230.pdf; ComponentLink8URL: https://datasheet.ciiva.com/31402/109718-31402206.pdf; ComponentLink8Description: https://datasheet.ciiva.com/31402/109718-31402206.pdf; ComponentLink9URL: https://datasheet.ciiva.com/26787/prtr5v0u2x-215-26787348.pdf; ComponentLink9Description: https://datasheet.ciiva.com/26787/prtr5v0u2x-215-26787348.pdf; Supplier Part Number 1: 1727-3884-1-ND
U7 = SN74LVC1G04QDBVRQ1: IC SNGL INVERTER GATE; Manufacturer: Texas Instruments; Logic Type: Inverter, Buffer; Number of Circuits: 1; Voltage - Supply: 1.65 V ~ 5.5 V; Current - Quiescent (Max): 10µA; Current - Output High, Low: 32mA, 32mA; Logic Level - Low: 0.7 V ~ 0.8 V; Logic Level - High: 1.7 V ~ 2 V; Max Propagation Delay @ V, Max CL: 3.7ns @ 5V, 50pF; Dynamic Catalog: 74LVC; Other Names: 296-26588-6; Manufacturer Part Number: SN74LVC1G04QDBVRQ1; Supplier 1: Digi-Key; Stock 1: 4515; Pricing 1: 1=0.35, 10=0.286, 100=0.1945, 500=0.1458, 1000=0.1094 (USD); Standard Package: 1; Category: Integrated Circuits (ICs); Family: Logic - Gates and Inverters; Series: 74LVC; Number of Inputs: 1; Features: -; Operating Temperature: -40°C ~ 125°C; Mounting Type: Surface Mount; Supplier Device Package: SOT-23-5; Package / Case: SC-74A, SOT-753; Packaging: Digi-Reel®; ComponentLink1URL: https://datasheet.ciiva.com/1864/sn74lvc1g04-q1-1864823.pdf; ComponentLink1Description: https://datasheet.ciiva.com/1864/sn74lvc1g04-q1-1864823.pdf; ComponentLink2URL: https://datasheet.ciiva.com/1864/sn74lvc1g04-q1-1864824.pdf; ComponentLink2Description: https://datasheet.ciiva.com/1864/sn74lvc1g04-q1-1864824.pdf; ComponentLink3URL: https://datasheet.ciiva.com/1864/sn74lvc1g04-q1-1864825.pdf; ComponentLink3Description: https://datasheet.ciiva.com/1864/sn74lvc1g04-q1-1864825.pdf; ComponentLink4URL: https://datasheet.ciiva.com/4219/sces482d-4219660.pdf; ComponentLink4Description: https://datasheet.ciiva.com/4219/sces482d-4219660.pdf; ComponentLink5URL: https://datasheet.ciiva.com/26044/sn74lvc1g04-q1-26044156.pdf; ComponentLink5Description: https://datasheet.ciiva.com/26044/sn74lvc1g04-q1-26044156.pdf; ComponentLink6URL: https://datasheet.ciiva.com/15089/getdatasheetpartid-190022-15089373.pdf; ComponentLink6Description: https://datasheet.ciiva.com/15089/getdatasheetpartid-190022-15089373.pdf; Supplier Part Number 1: 296-26588-1-ND
Y1 = AT-24.000MAGE-T: 24MHz ±30ppm Crystal 12pF 50 Ohm -40°C ~ 85°C AEC-Q200 Surface Mount HC49/US; Manufacturer: TXC; Frequency Stability: ±50ppm; ESR (Equivalent Series Resistance): 50 Ohm; Operating Mode: Fundamental; Online Catalog: AT Series; Other Names: 887-1613-6; Supplier 1: Digikey; Manufacturer Part Number: AT-24.000MAGE-T; Stock 1: 380; Pricing 1: 1=0.66, 10=0.55, 50=0.495, 100=0.44, 500=0.418 (USD); Standard Package: 1; Category: Crystals and Oscillators; Family: Crystals; Series: AT; Packaging: Digi-Reel®; Type: MHz Crystal; Frequency: 24MHz; Frequency Tolerance: ±30ppm; Load Capacitance: 12pF; Operating Temperature: -40°C ~ 85°C; Ratings: AEC-Q200; Mounting Type: Surface Mount; Package / Case: HC49/US; Size / Dimension: 0.449" L x 0.189" W (11.40mm x 4.80mm); Height: 0.161" (4.10mm); ComponentLink1URL: https://datasheet.ciiva.com/4946/at-automotive-3382-4946832.pdf; ComponentLink1Description: https://datasheet.ciiva.com/4946/at-automotive-3382-4946832.pdf; ComponentLink2URL: https://datasheet.ciiva.com/8047/1639142-8047989.pdf; ComponentLink2Description: https://datasheet.ciiva.com/8047/1639142-8047989.pdf; ComponentLink3URL: https://datasheet.ciiva.com/6728/at-automotive-6728858.pdf; ComponentLink3Description: https://datasheet.ciiva.com/6728/at-automotive-6728858.pdf; ComponentLink4URL: https://datasheet.ciiva.com/6728/at-automotive-6728859.pdf; ComponentLink4Description: https://datasheet.ciiva.com/6728/at-automotive-6728859.pdf; ComponentLink5URL: https://datasheet.ciiva.com/6728/at-automotive-6728860.pdf; ComponentLink5Description: https://datasheet.ciiva.com/6728/at-automotive-6728860.pdf; Supplier Part Number 1: 887-1613-1-ND
P1-P4 = Plug: LatestRevisionDate: 17-Jul-2002; LatestRevisionNote: Re-released for DXP Platform.; Publisher: Altium Limited